# EasyEDA schematic SP26_brainstim3_FullPowerSchematic_aadhihari.json

## Sheets
1 Overall Integration of Power Circuit: TITLE: Final Power Schematics; REV: 15.1; Date: 2026-03-18; Sheet: 1/1; Drawn By: ahari3; Company: Your Company
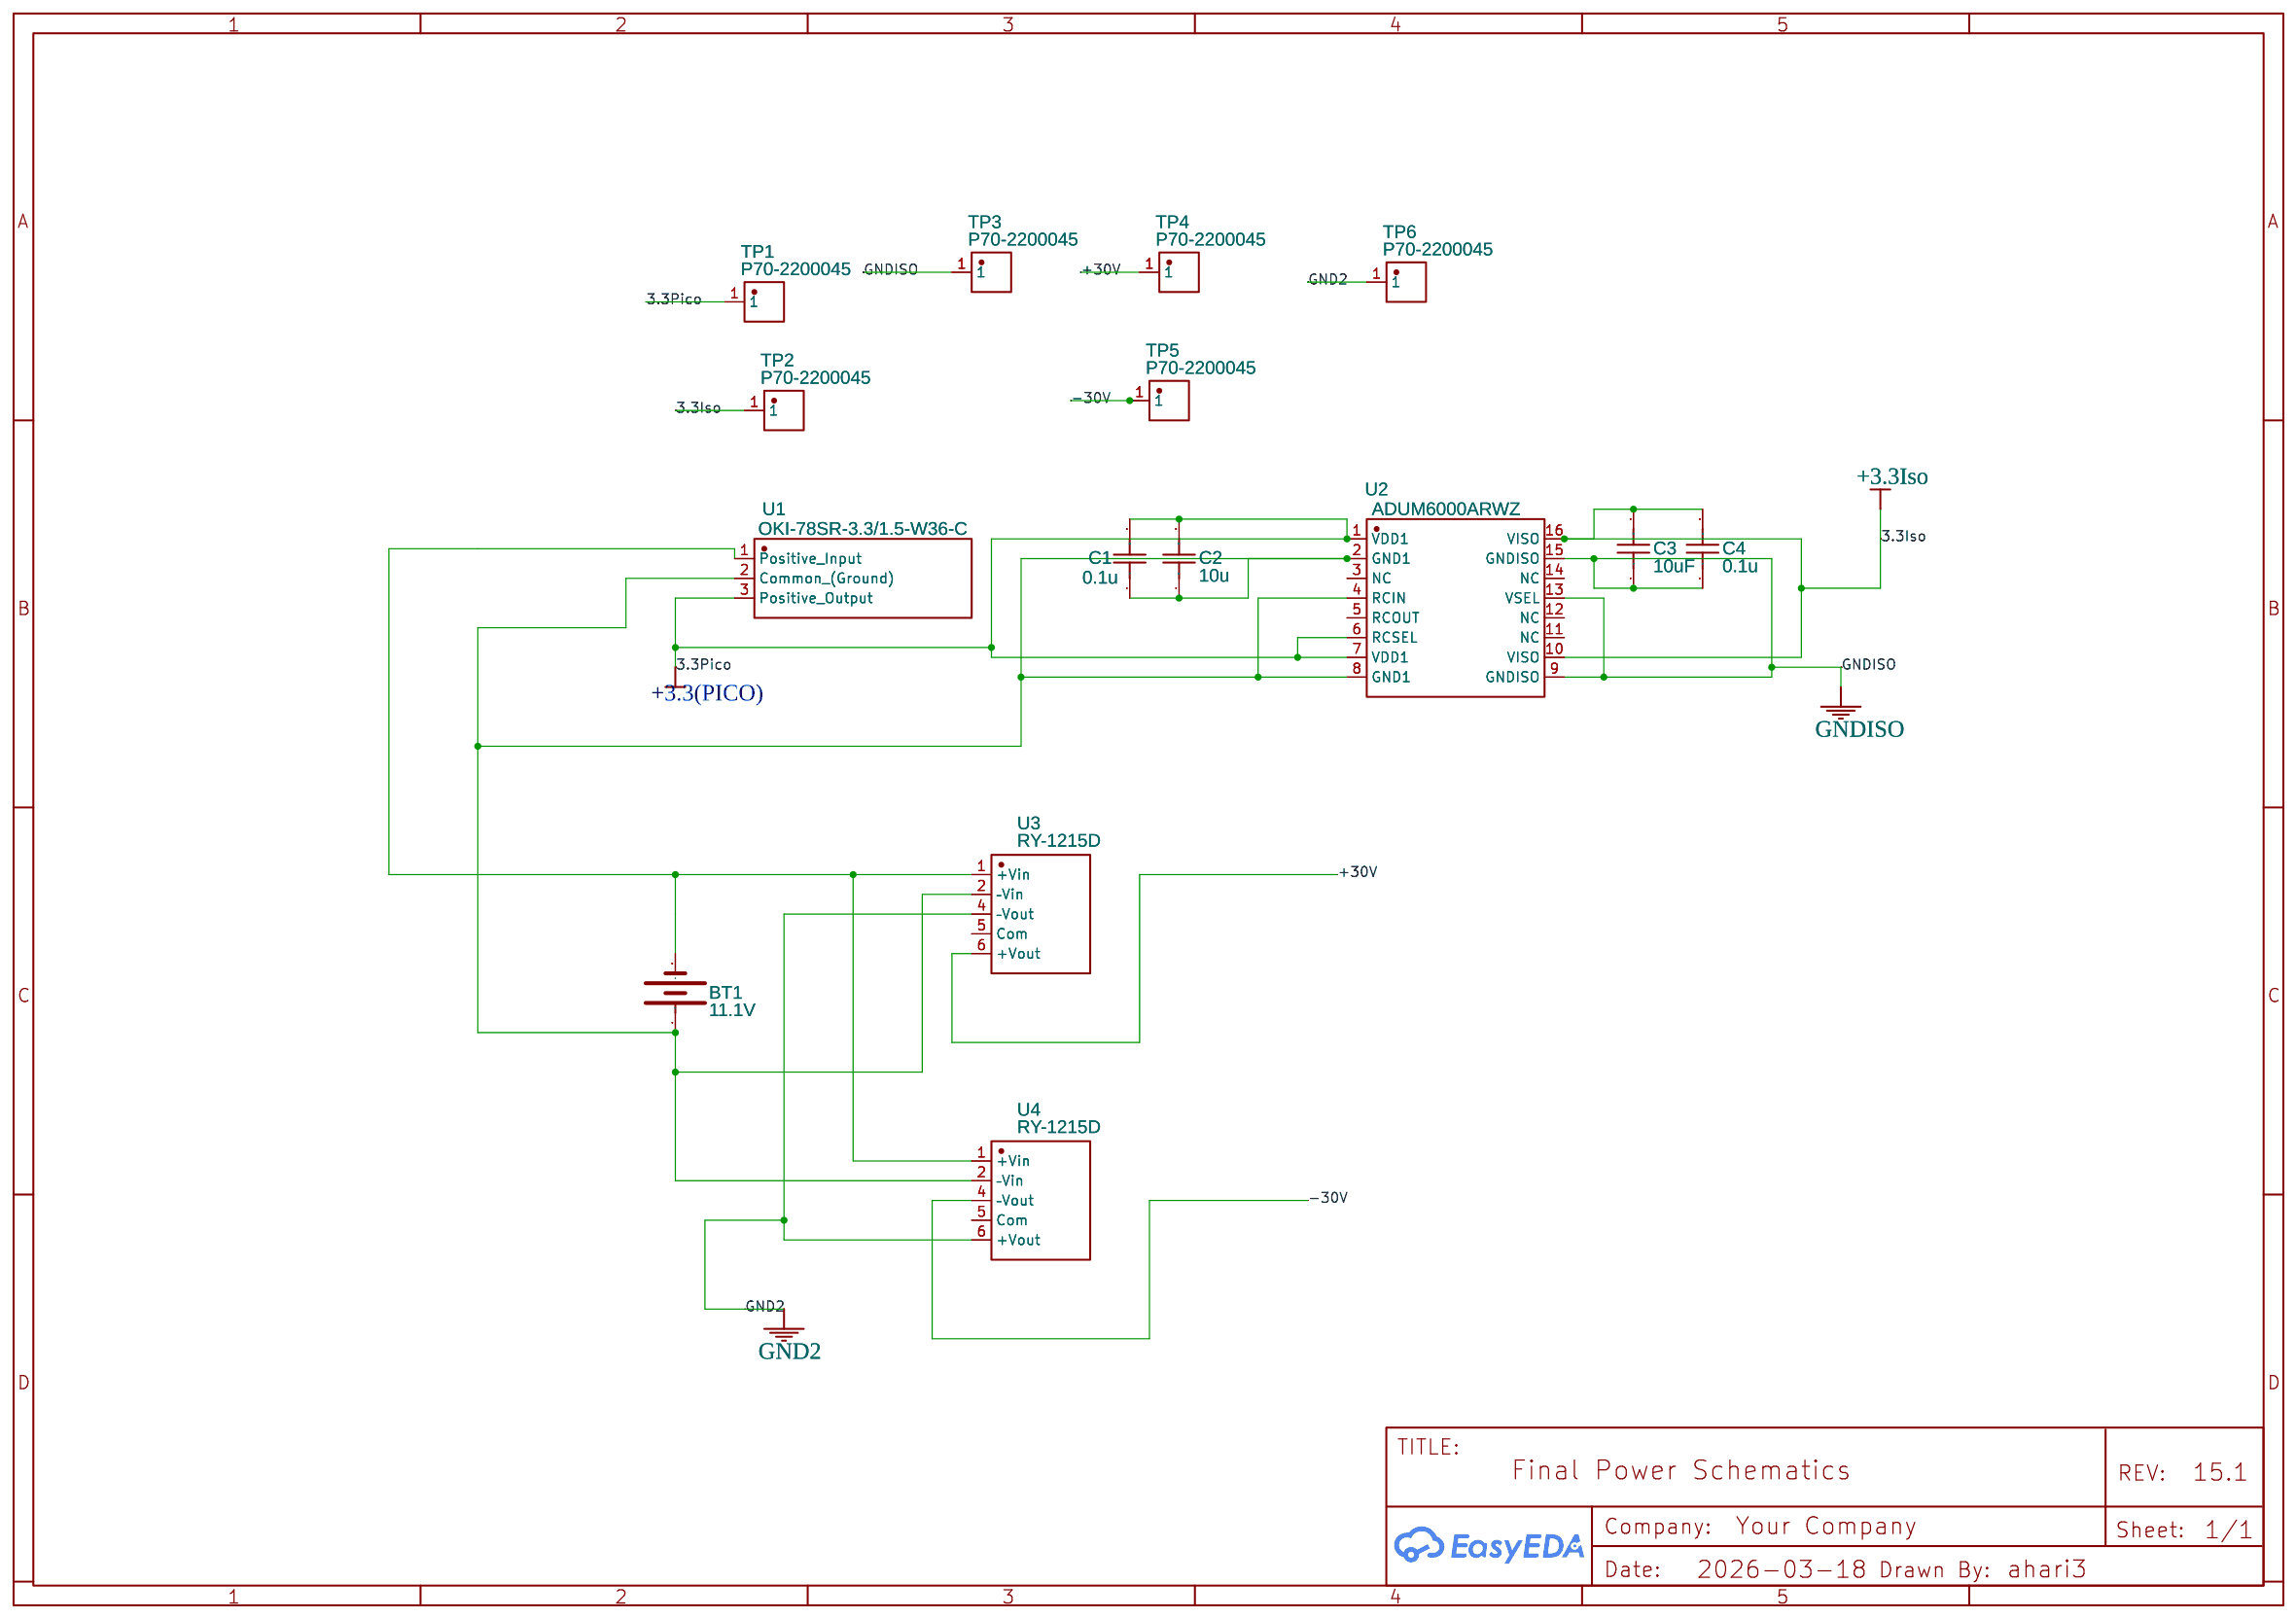
[diagram p0: Overall Integration of Power Circuit]
2 3.3V Power Supply Schematic copy: TITLE: 3.3V Power Supply Design; Company: Aadhi Hari
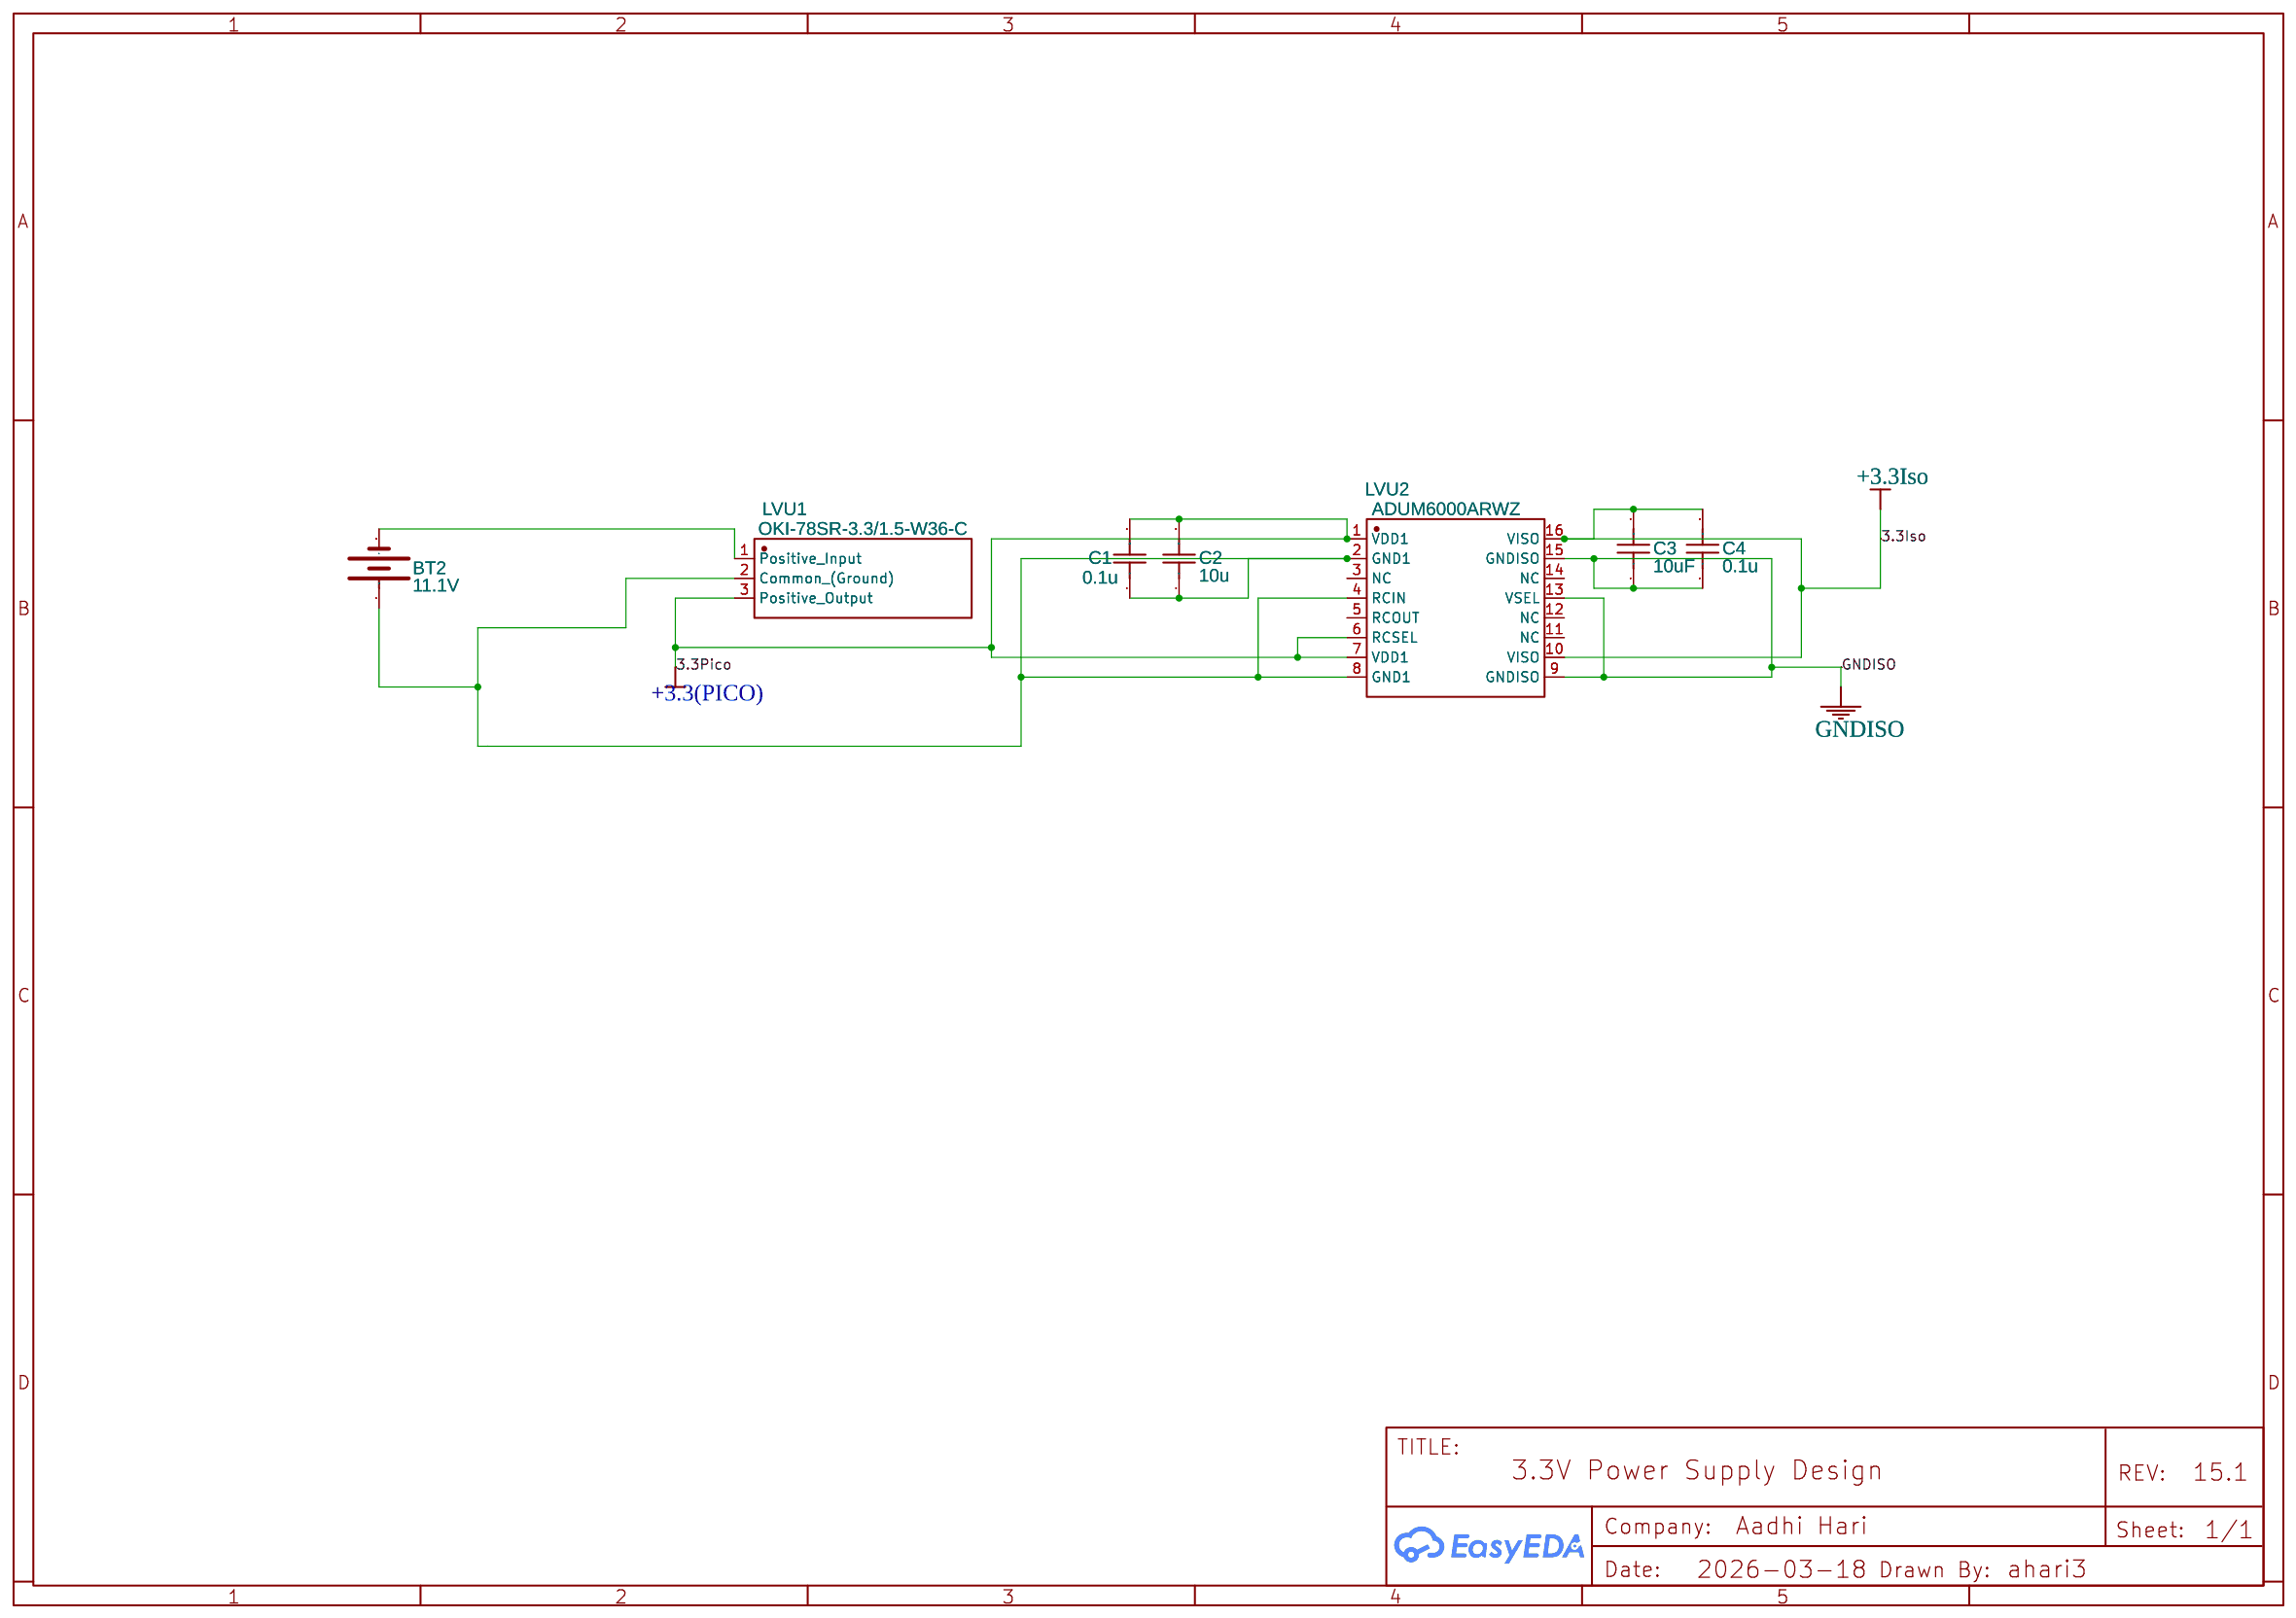
[diagram p1: 3.3V Power Supply Schematic copy]
3 High Voltage Circuitry: TITLE: High Voltage subcircut; Company: Aadhi Hari
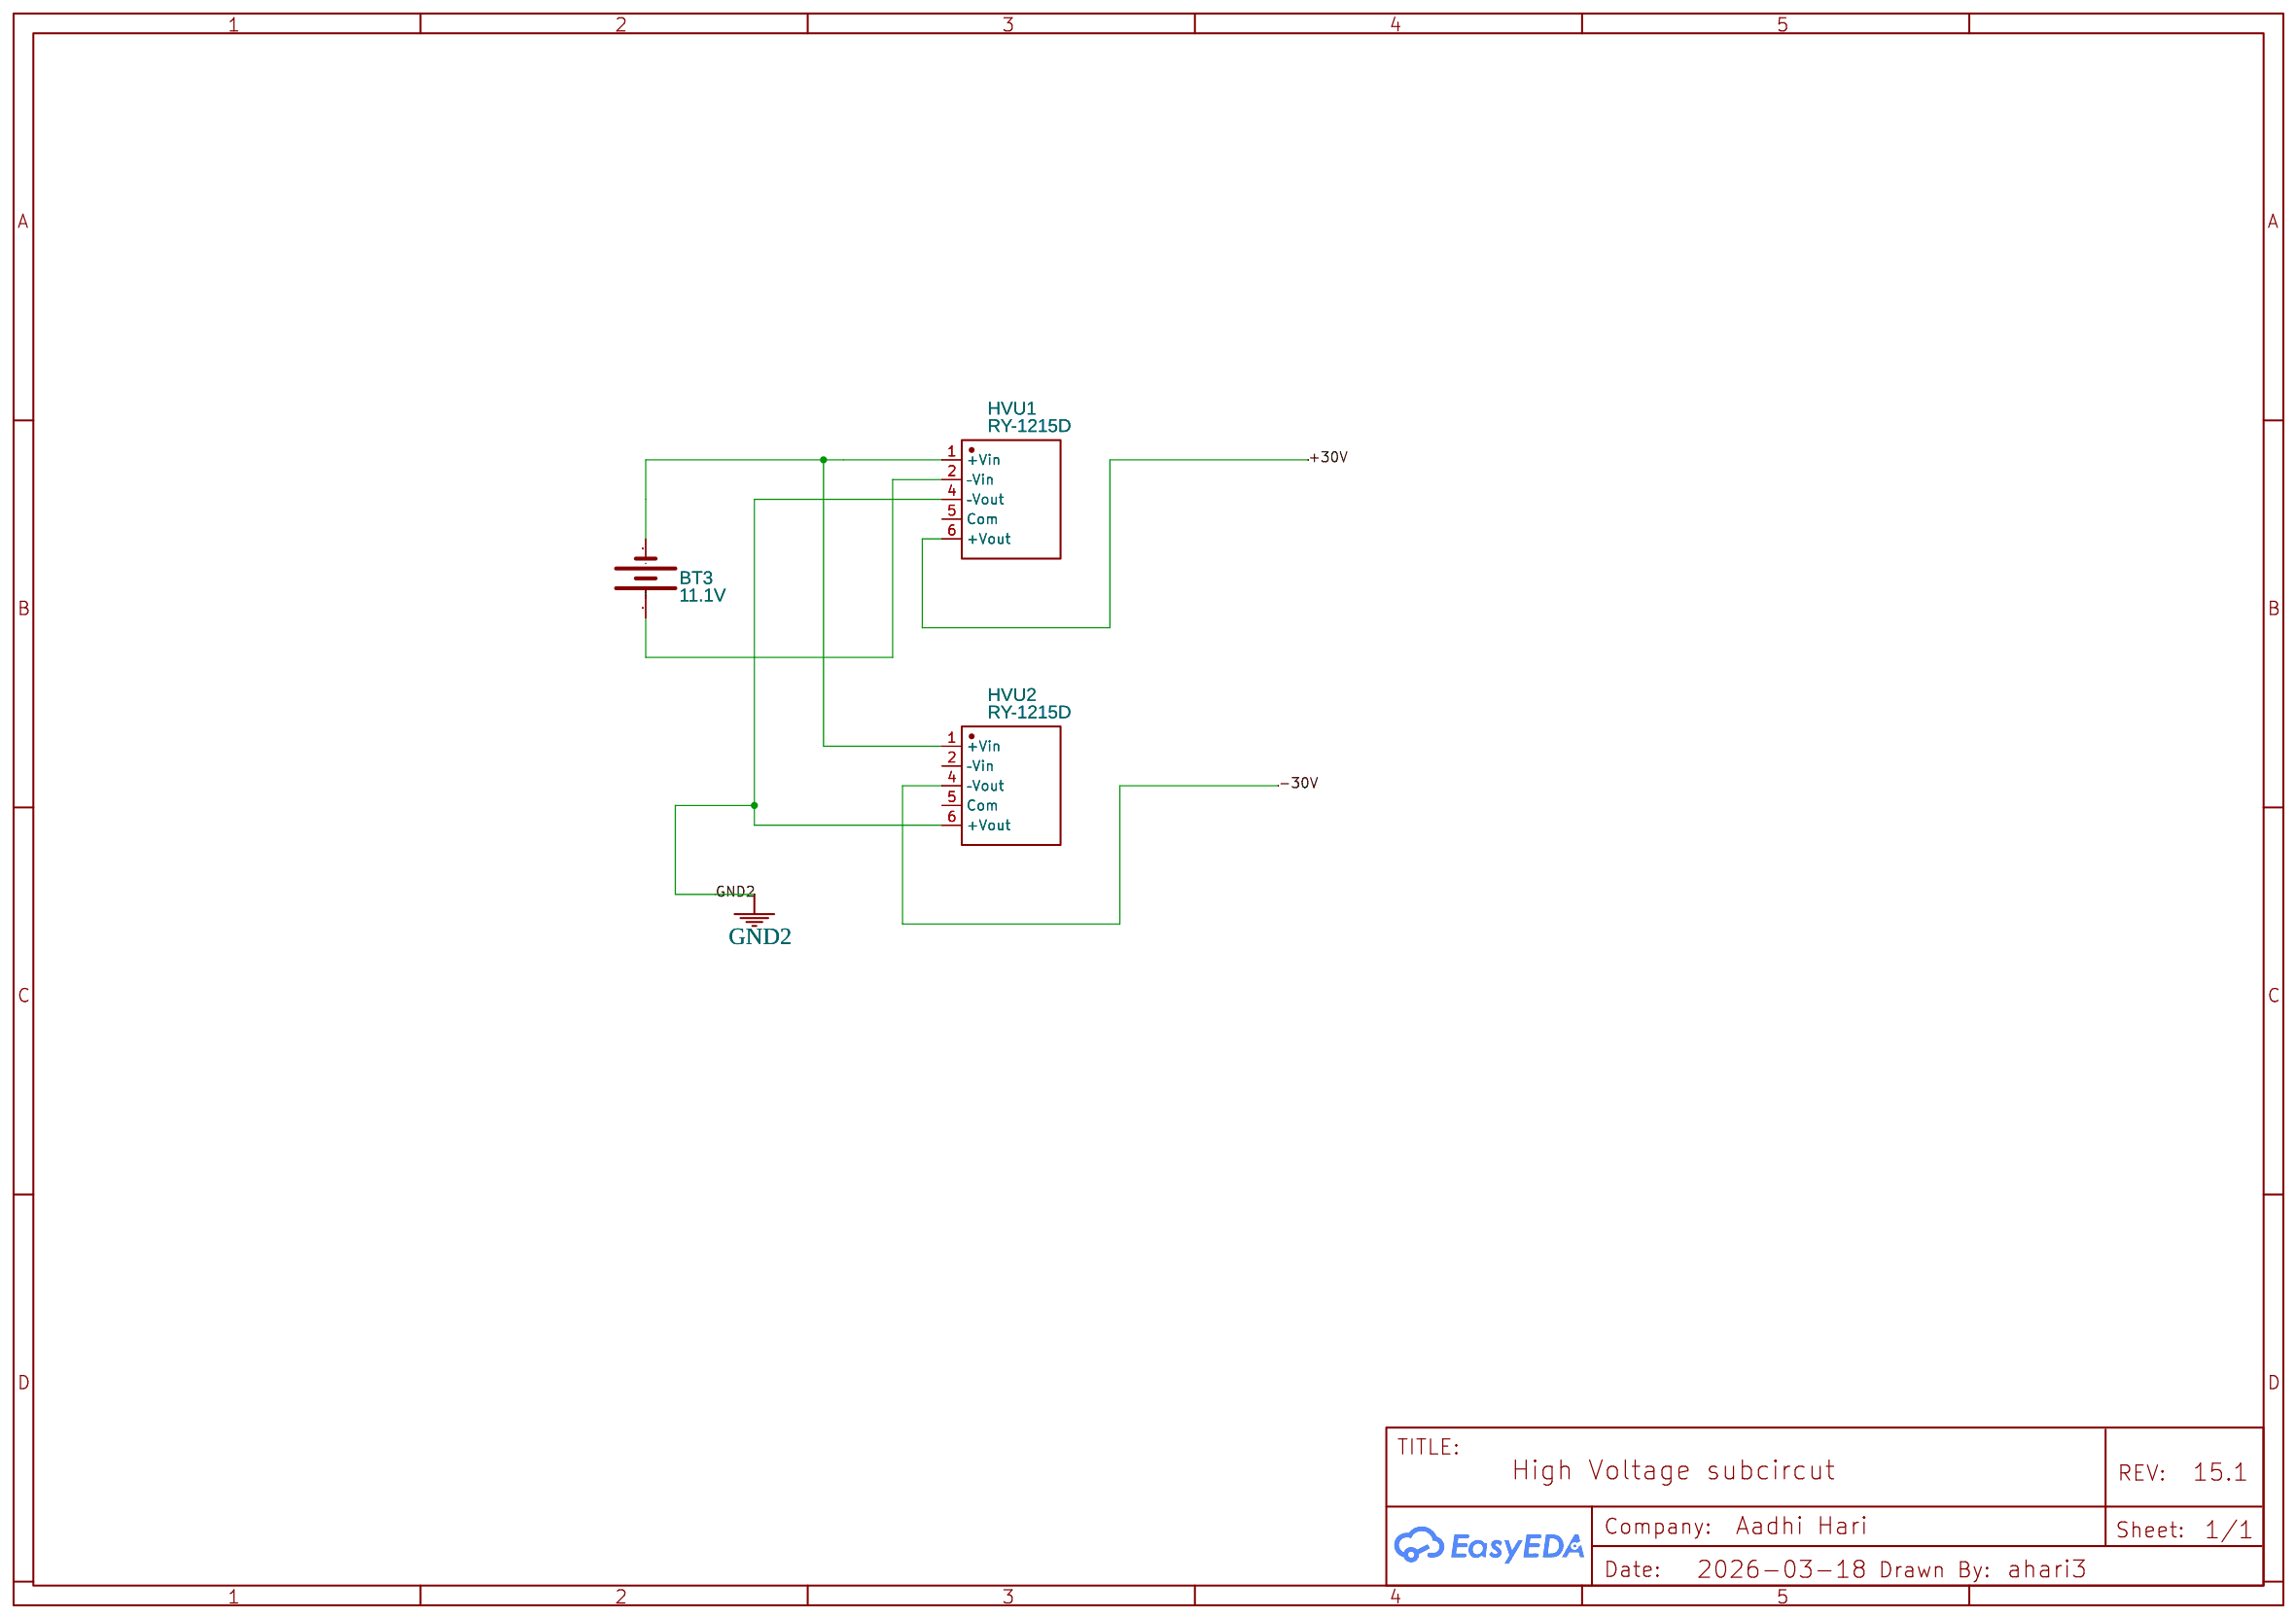
[diagram p2: High Voltage Circuitry]

## Parts
sheet 3.3V Power Supply Schematic copy
BT2  11.1V  [BAT-TH_2P-9VBATTERY]
C1#2  0.1u  [C0603]
C2#2  10u  [C0603]
C3#2  10uF  [C0603]
C4#2  0.1u  [C0603]
LVU1  OKI-78SR-3.3/1.5-W36-C  [PWRM-TH_OKI-78SR-3.3-1.5-W36-C]
LVU2  ADUM6000ARWZ  [SOIC-16_L10.3-W7.4-P1.27-LS10.3-BL]
sheet High Voltage Circuitry
BT3  11.1V  [BAT-TH_2P-9VBATTERY]
HVU1  RY-1215D  [PWRM-TH_RECOM_RY-XXXXS]
HVU2  RY-1215D  [PWRM-TH_RECOM_RY-XXXXS]
sheet Overall Integration of Power Circuit
BT1  11.1V  [BAT-TH_2P-9VBATTERY]
C1  0.1u  [C0603]
C2  10u  [C0603]
C3  10uF  [C0603]
C4  0.1u  [C0603]
TP1  P70-2200045  [TESTPOINT-TH_BD2.0-D1.0_TESTPOINT-TH_BD2.0-D1.0]
TP2  P70-2200045  [TESTPOINT-TH_BD2.0-D1.0_TESTPOINT-TH_BD2.0-D1.0]
TP3  P70-2200045  [TESTPOINT-TH_BD2.0-D1.0_TESTPOINT-TH_BD2.0-D1.0]
TP4  P70-2200045  [TESTPOINT-TH_BD2.0-D1.0_TESTPOINT-TH_BD2.0-D1.0]
TP5  P70-2200045  [TESTPOINT-TH_BD2.0-D1.0_TESTPOINT-TH_BD2.0-D1.0]
TP6  P70-2200045  [TESTPOINT-TH_BD2.0-D1.0_TESTPOINT-TH_BD2.0-D1.0]
U1  OKI-78SR-3.3/1.5-W36-C  [PWRM-TH_OKI-78SR-3.3-1.5-W36-C]
U2  ADUM6000ARWZ  [SOIC-16_L10.3-W7.4-P1.27-LS10.3-BL]
U3  RY-1215D  [PWRM-TH_RECOM_RY-XXXXS]
U4  RY-1215D  [PWRM-TH_RECOM_RY-XXXXS]

## Library data of the parts
BT1-BT3 = 9V电池铜线扣 铜100MM: Supplier: LCSC; Supplier Part: C70374; Manufacturer: QIJEY; Manufacturer Part: 9V电池铜线扣 铜100mm; JLCPCB Part Class: Extended Part; Contributor: lcsc
C1 C1#2 C2 C2#2 C3 C3#2 C4 C4#2 = C_0603_US: Contributor: LCEDA_Lib
LVU1 U1 = OKI-78SR-3.3/1.5-W36-C: Supplier: LCSC; Supplier Part: C9900205302; Manufacturer: null; Contributor: lcsc
LVU2 U2 = ADUM6000ARWZ: Contributor: LCSC; Supplier: LCSC; Supplier Part: C661383; Manufacturer: ADI(亚德诺); JLCPCB Part Class: Extended Part
HVU1 HVU2 U3 U4 = RY-1215D: Supplier: LCSC; Supplier Part: C7353859; Manufacturer: Recom Power; JLCPCB Part Class: Extended Part; Contributor: lcsc
TP1-TP6 = P70-2200045: Supplier: LCSC; Supplier Part: C21890164; Manufacturer: Harwin; JLCPCB Part Class: Extended Part; Contributor: lcsc

## Nets
+30V: HVU1.6(+Vout) TP4.1 U3.6(+Vout)
-30V: HVU2.4(–Vout) TP5.1 U4.4(–Vout)
GND2: HVU1.4(–Vout) HVU2.6(+Vout) TP6.1 U3.4(–Vout) U4.6(+Vout)
GNDISO: C3.1 C3#2.1 C4.1 C4#2.1 LVU2.9(GNDISO) LVU2.13(VSEL) LVU2.15(GNDISO) TP3.1 U2.9(GNDISO) U2.13(VSEL) U2.15(GNDISO)
+3.3(PICO): C1.2 C1#2.2 C2.2 C2#2.2 LVU1.3(Positive Output) LVU2.1(VDD1) LVU2.6(RCSEL) LVU2.7(VDD1) TP1.1 U1.3(Positive Output) U2.1(VDD1) U2.6(RCSEL) U2.7(VDD1)
+3.3Iso: C3.2 C3#2.2 C4.2 C4#2.2 LVU2.10(VISO) LVU2.16(VISO) TP2.1 U2.10(VISO) U2.16(VISO)
Net-(BT1-1): BT1.1(+) C1.1 C2.1 U1.2(Common (Ground)) U2.2(GND1) U2.4(RCIN) U2.8(GND1) U3.2(–Vin) U4.2(–Vin)
Net-(BT1-2): BT1.2(-) U1.1(Positive Input) U3.1(+Vin) U4.1(+Vin)
Net-(BT2-1): BT2.1(+) C1#2.1 C2#2.1 LVU1.2(Common (Ground)) LVU2.2(GND1) LVU2.4(RCIN) LVU2.8(GND1)
Net-(BT2-2): BT2.2(-) LVU1.1(Positive Input)
Net-(BT3-1): BT3.1(+) HVU1.2(–Vin)
Net-(BT3-2): BT3.2(-) HVU1.1(+Vin) HVU2.1(+Vin)

Not connected (* = marked no-connect by the designer): HVU1 5(Com); HVU2 2(–Vin) 5(Com); LVU2 3(NC) 5(RCOUT) 11(NC) 12(NC) 14(NC); U2 3(NC) 5(RCOUT) 11(NC) 12(NC) 14(NC); U3 5(Com); U4 5(Com)
